# Altium schematic sheet 开关.SchDoc
size A2
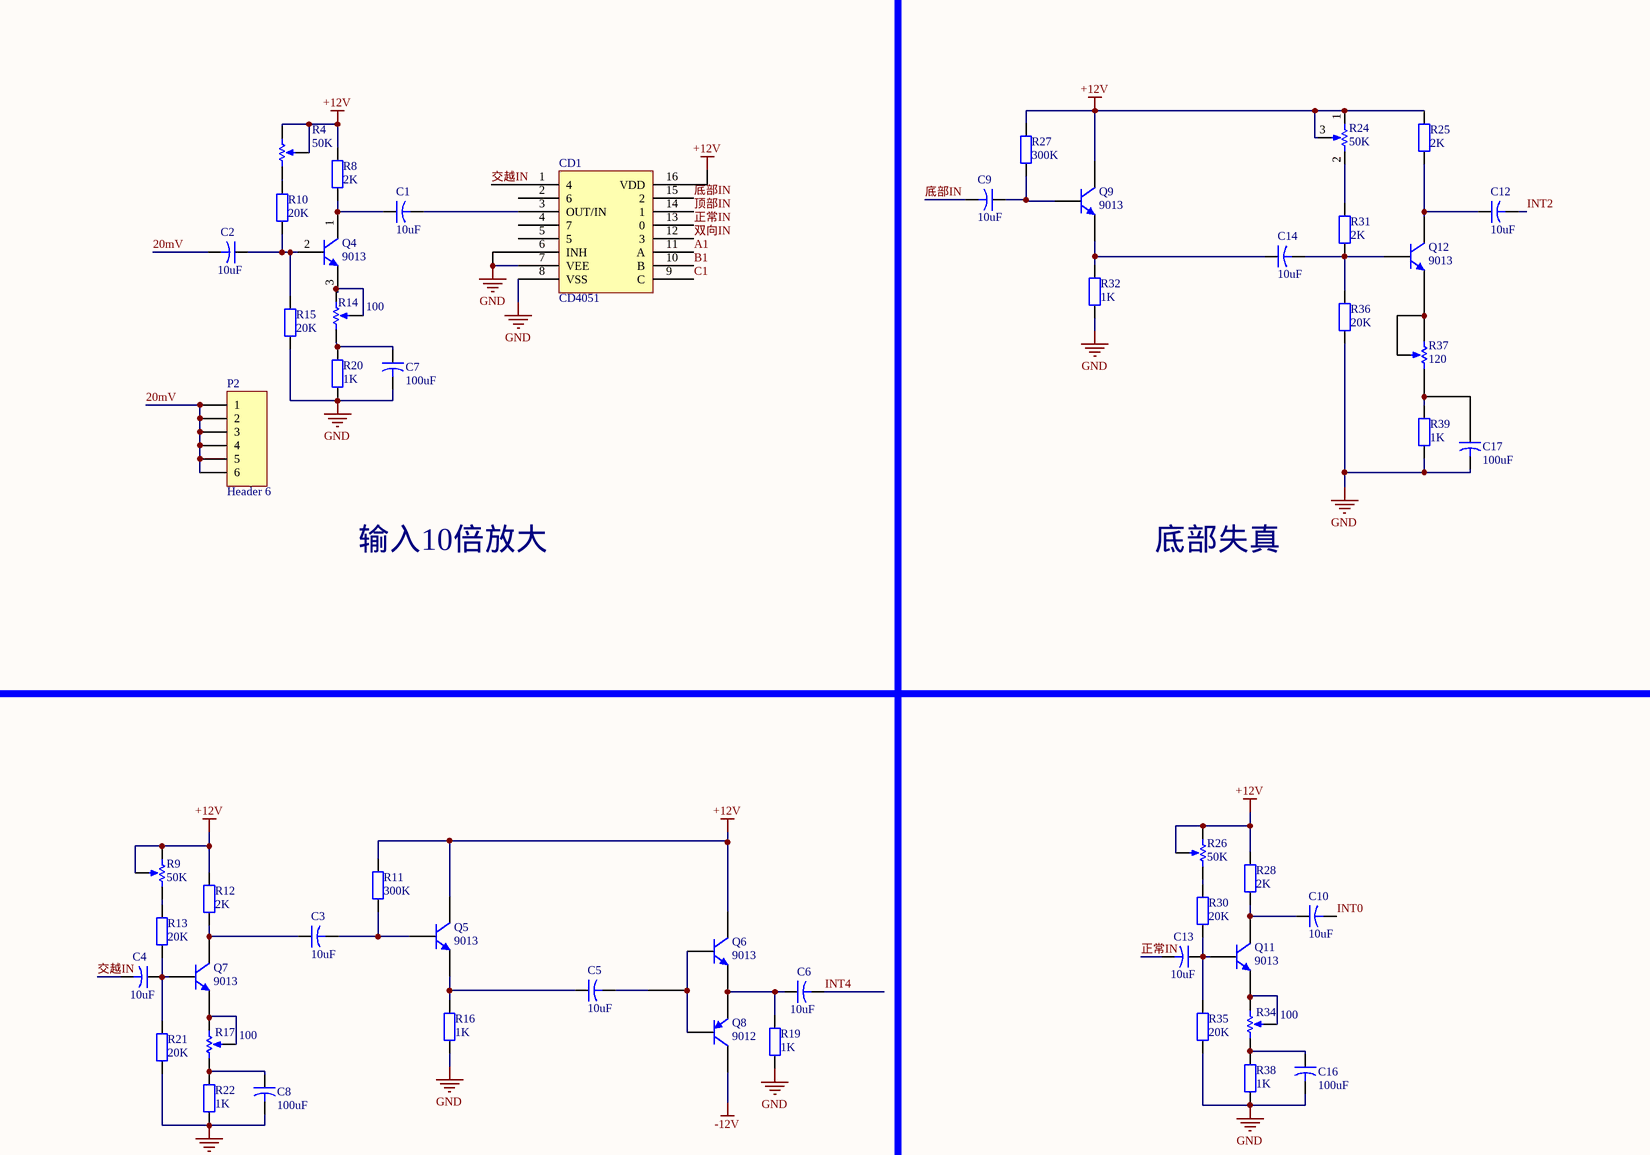
[diagram p0: 开关.SchDoc, top left]
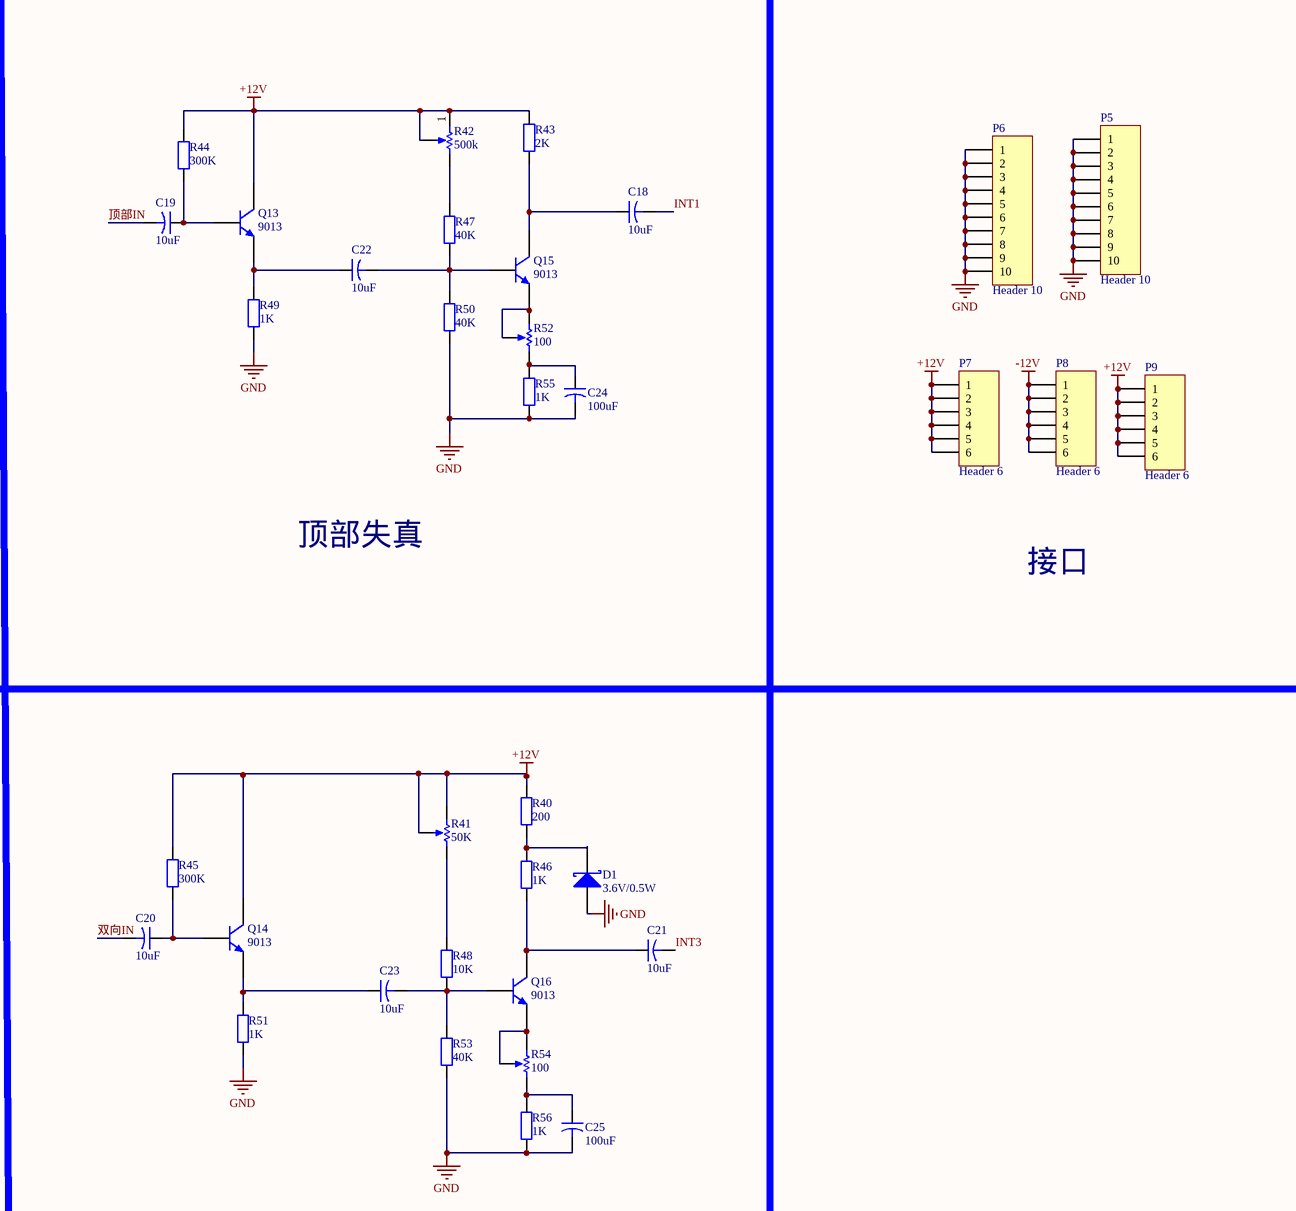
[diagram p1: 开关.SchDoc, top right]
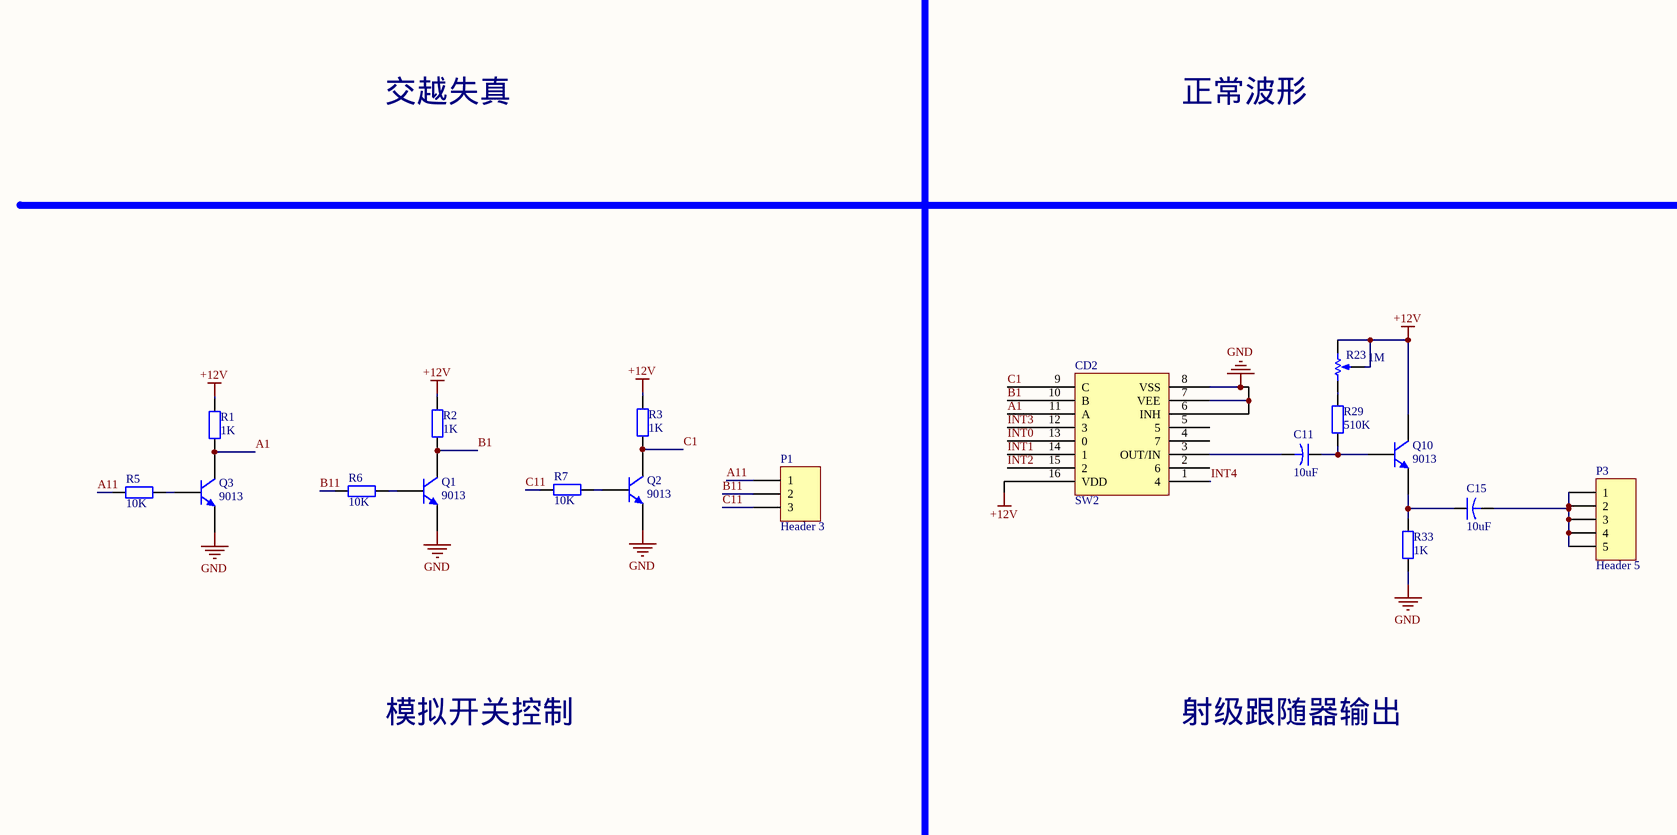
[diagram p2: 开关.SchDoc, bottom left]
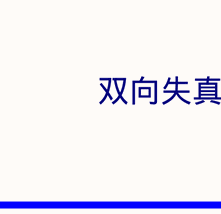
[diagram p3: 开关.SchDoc, bottom right]

## Parts
C1  10uF  [CAPR5-4X5]
C2  10uF  [CAPR5-4X5]
C3  10uF  [CAPR5-4X5]
C4  10uF  [CAPR5-4X5]
C5  10uF  [CAPR5-4X5]
C6  10uF  [CAPR5-4X5]
C7  100uF  [CAPR5-4X5]
C8  100uF  [CAPR5-4X5]
C9  10uF  [CAPR5-4X5]
C10  10uF  [CAPR5-4X5]
C11  10uF  [CAPR5-4X5]
C12  10uF  [CAPR5-4X5]
C13  10uF  [CAPR5-4X5]
C14  10uF  [CAPR5-4X5]
C15  10uF  [CAPR5-4X5]
C16  100uF  [CAPR5-4X5]
C17  100uF  [CAPR5-4X5]
C18  10uF  [CAPR5-4X5]
C19  10uF  [CAPR5-4X5]
C20  10uF  [CAPR5-4X5]
C21  10uF  [CAPR5-4X5]
C22  10uF  [CAPR5-4X5]
C23  10uF  [CAPR5-4X5]
C24  100uF  [CAPR5-4X5]
C25  100uF  [CAPR5-4X5]
CD1  CD4051  [DIP-16]
CD2  SW2  [DIP-16]
D1  3.6V/0.5W  [DO-41]
P1  Header 3  [HDR1X3]
P2  Header 6  [HDR1X6]
P3  Header 5  [HDR1X5]
P5  Header 10  [HDR1X10]
P6  Header 10  [HDR1X10]
P7  Header 6  [HDR1X6]
P8  Header 6  [HDR1X6]
P9  Header 6  [HDR1X6]
Q1  9013  [HDR1X3]
Q2  9013  [HDR1X3]
Q3  9013  [HDR1X3]
Q4  9013  [HDR1X3]
Q5  9013  [HDR1X3]
Q6  9013  [HDR1X3]
Q7  9013  [HDR1X3]
Q8  9012  [HDR1X3]
Q9  9013  [HDR1X3]
Q10  9013  [HDR1X3]
Q11  9013  [HDR1X3]
Q12  9013  [HDR1X3]
Q13  9013  [HDR1X3]
Q14  9013  [HDR1X3]
Q15  9013  [HDR1X3]
Q16  9013  [HDR1X3]
R1  1K  [AXIAL-0.4]
R2  1K  [AXIAL-0.4]
R3  1K  [AXIAL-0.4]
R4  50K  [VR5]
R5  10K  [AXIAL-0.4]
R6  10K  [AXIAL-0.4]
R7  10K  [AXIAL-0.4]
R8  2K  [AXIAL-0.4]
R9  50K  [VR5]
R10  20K  [AXIAL-0.4]
R11  300K  [AXIAL-0.4]
R12  2K  [AXIAL-0.4]
R13  20K  [AXIAL-0.4]
R14  100  [VR5]
R15  20K  [AXIAL-0.4]
R16  1K  [AXIAL-0.4]
R17  100  [VR5]
R19  1K  [AXIAL-0.4]
R20  1K  [AXIAL-0.4]
R21  20K  [AXIAL-0.4]
R22  1K  [AXIAL-0.4]
R23  1M  [VR5]
R24  50K  [VR5]
R25  2K  [AXIAL-0.4]
R26  50K  [VR5]
R27  300K  [AXIAL-0.4]
R28  2K  [AXIAL-0.4]
R29  510K  [AXIAL-0.4]
R30  20K  [AXIAL-0.4]
R31  2K  [AXIAL-0.4]
R32  1K  [AXIAL-0.4]
R33  1K  [AXIAL-0.4]
R34  100  [VR5]
R35  20K  [AXIAL-0.4]
R36  20K  [AXIAL-0.4]
R37  120  [VR5]
R38  1K  [AXIAL-0.4]
R39  1K  [AXIAL-0.4]
R40  200  [AXIAL-0.4]
R41  50K  [VR5]
R42  500k  [VR5]
R43  2K  [AXIAL-0.4]
R44  300K  [AXIAL-0.4]
R45  300K  [AXIAL-0.4]
R46  1K  [AXIAL-0.4]
R47  40K  [AXIAL-0.4]
R48  10K  [AXIAL-0.4]
R49  1K  [AXIAL-0.4]
R50  40K  [AXIAL-0.4]
R51  1K  [AXIAL-0.4]
R52  100  [VR5]
R53  40K  [AXIAL-0.4]
R54  100  [VR5]
R55  1K  [AXIAL-0.4]
R56  1K  [AXIAL-0.4]

## Nets
+12V: CD1.16(VDD) CD2.16(VDD) P7.1 P7.2 P7.3 P7.4 P7.5 P7.6 P9.1 P9.2 P9.3 P9.4 P9.5 P9.6 Q5.1(C) Q6.1(C) Q9.1(C) Q10.1(C) Q13.1(C) Q14.1(C) R1.2 R2.2 R3.2 R4.2(BOT) R4.3(TAP) R8.2 R9.1(TOP) R9.3(TAP) R11.2 R12.2 R23.2(BOT) R23.3(TAP) R24.1(TOP) R24.3(TAP) R25.2 R26.1(TOP) R26.3(TAP) R27.2 R28.2 R40.2 R41.1(TOP) R41.3(TAP) R42.1(TOP) R42.3(TAP) R43.2 R44.2 R45.2
-12V: P8.1 P8.2 P8.3 P8.4 P8.5 P8.6 Q8.1(C)
GND: C7.2 C8.2 C16.2 C17.2 C24.2 C25.2 CD1.6(INH) CD1.7(VEE) CD1.8(VSS) CD2.6(INH) CD2.7(VEE) CD2.8(VSS) D1.1(A) P5.1 P5.2 P5.3 P5.4 P5.5 P5.6 P5.7 P5.8 P5.9 P5.10 P6.1 P6.2 P6.3 P6.4 P6.5 P6.6 P6.7 P6.8 P6.9 P6.10 Q1.3(E) Q2.3(E) Q3.3(E) R15.1 R16.1 R19.1 R20.1 R21.1 R22.1 R32.1 R33.1 R35.1 R36.1 R38.1 R39.1 R49.1 R50.1 R51.1 R53.1 R55.1 R56.1
20mV: C2.2 P2.1 P2.2 P2.3 P2.4 P2.5 P2.6
A1: CD1.11(A) CD2.11(A) Q3.1(C) R1.1
A11: P1.1 R5.2
B1: CD1.10(B) CD2.10(B) Q1.1(C) R2.1
B11: P1.2 R6.2
C1: CD1.9(C) CD2.9(C) Q2.1(C) R3.1
C11: P1.3 R7.2
INT0: C10.2 CD2.13(0)
INT1: C18.2 CD2.14(1)
INT2: C12.2 CD2.15(2)
INT3: C21.2 CD2.12(3)
INT4: C6.2 CD2.1(4)
交越IN: C4.2 CD1.1(4)
双向IN: C20.2 CD1.12(3)
底部IN: C9.2 CD1.15(2)
正常IN: C13.2 CD1.13(0)
顶部IN: C19.2 CD1.14(1)
NetC1_1: C1.1 Q4.1(C) R8.1
NetC1_2: C1.2 CD1.3(OUT/IN)
NetC2_1: C2.1 Q4.2(B) R10.1 R15.2
NetC3_1: C3.1 Q7.1(C) R12.1
NetC3_2: C3.2 Q5.2(B) R11.1
NetC4_1: C4.1 Q7.2(B) R13.1 R21.2
NetC5_1: C5.1 Q5.3(E) R16.2
NetC5_2: C5.2 Q6.2(B) Q8.2(B)
NetC6_1: C6.1 Q6.3(E) Q8.3(E) R19.2
NetC7_1: C7.1 R14.1(TOP) R20.2
NetC8_1: C8.1 R17.1(TOP) R22.2
NetC9_1: C9.1 Q9.2(B) R27.1
NetC10_1: C10.1 Q11.1(C) R28.1
NetC11_1: C11.1 Q10.2(B) R29.1
NetC11_2: C11.2 CD2.3(OUT/IN)
NetC12_1: C12.1 Q12.1(C) R25.1
NetC13_1: C13.1 Q11.2(B) R30.1 R35.2
NetC14_1: C14.1 Q9.3(E) R32.2
NetC14_2: C14.2 Q12.2(B) R31.1 R36.2
NetC15_1: C15.1 Q10.3(E) R33.2
NetC15_2: C15.2 P3.1 P3.2 P3.3 P3.4 P3.5
NetC16_1: C16.1 R34.1(TOP) R38.2
NetC17_1: C17.1 R37.2(BOT) R39.2
NetC18_1: C18.1 Q15.1(C) R43.1
NetC19_1: C19.1 Q13.2(B) R44.1
NetC20_1: C20.1 Q14.2(B) R45.1
NetC21_1: C21.1 Q16.1(C) R46.1
NetC22_1: C22.1 Q13.3(E) R49.2
NetC22_2: C22.2 Q15.2(B) R47.1 R50.2
NetC23_1: C23.1 Q14.3(E) R51.2
NetC23_2: C23.2 Q16.2(B) R48.1 R53.2
NetC24_1: C24.1 R52.2(BOT) R55.2
NetC25_1: C25.1 R54.2(BOT) R56.2
NetD1_2: D1.2(K) R40.1 R46.2
NetQ1_2: Q1.2(B) R6.1
NetQ2_2: Q2.2(B) R7.1
NetQ3_2: Q3.2(B) R5.1
NetQ4_3: Q4.3(E) R14.2(BOT) R14.3(TAP)
NetQ7_3: Q7.3(E) R17.2(BOT) R17.3(TAP)
NetQ11_3: Q11.3(E) R34.2(BOT) R34.3(TAP)
NetQ12_3: Q12.3(E) R37.1(TOP) R37.3(TAP)
NetQ15_3: Q15.3(E) R52.1(TOP) R52.3(TAP)
NetQ16_3: Q16.3(E) R54.1(TOP) R54.3(TAP)
NetR4_1: R4.1(TOP) R10.2
NetR9_2: R9.2(BOT) R13.2
NetR23_1: R23.1(TOP) R29.2
NetR24_2: R24.2(BOT) R31.2
NetR26_2: R26.2(BOT) R30.2
NetR41_2: R41.2(BOT) R48.2
NetR42_2: R42.2(BOT) R47.2

Not connected (* = marked no-connect by the designer): CD1 2(6) 4(7) 5; CD2 2(6) 4(7) 5

## Notes on the sheet
- 输入10倍放大
- 底部失真
- 顶部失真
- 接口
- 交越失真
- 正常波形
- 双向失真
- 模拟开关控制
- 射级跟随器输出
- Title
- Size:
- Date:
- File:
- A2
- Number:
- Time:
- Revision:
- Sheet
- of

## Library data of the parts
C1-C25 = Cap2: Capacitor; Published: 23-Sep-2002; PackageReference: CAPR5-4X5; Publisher: Altium Limited; PackageDescription: Capacitor; 2 Leads
CD1 CD2 = SW?
D1 = D Schottky: Schottky Diode; Published: 8-Jun-2000; LatestRevisionDate: 17-Jul-2002; LatestRevisionNote: Re-released for DXP Platform.; PackageReference: SMB; Publisher: Altium Limited; PackageDescription: DO-214-AA/SMB; 2 C-Bend Leads; Body 5.3 x 3.6 mm, inc. leads (LxW); Code_JEDEC: DO-214-AA
P1 = Header 3: Header, 3-Pin; LatestRevisionDate: 17-Jul-2002; LatestRevisionNote: Re-released for DXP Platform.; Publisher: Altium Limited
P2 P7-P9 = Header 6: Header, 6-Pin; LatestRevisionDate: 17-Jul-2002; LatestRevisionNote: Re-released for DXP Platform.; Publisher: Altium Limited
P3 = Header 5: Header, 5-Pin; LatestRevisionDate: 17-Jul-2002; LatestRevisionNote: Re-released for DXP Platform.; Publisher: Altium Limited
P5 P6 = Header 10: Header, 10-Pin; LatestRevisionDate: 17-Jul-2002; LatestRevisionNote: Re-released for DXP Platform.; Publisher: Altium Limited
Q1-Q7 Q9-Q16 = NPN: NPN Bipolar Transistor; pin to pad: 1>3 3>1; Published: 8-Jun-2000; LatestRevisionDate: 17-Jul-2002; LatestRevisionNote: Re-released for DXP Platform.; PackageReference: TO-226-AA; Publisher: Altium Limited; PackageDescription: TO, Flat Index; 3 In-Line, Axial Leads; Body Dia. 4.8mm; Leads 0.55 x 0.51 mm (max); Code_JEDEC: TO-226-AA
Q8 = PNP: PNP Bipolar Transistor; Published: 8-Jun-2000; LatestRevisionDate: 29-May-2009; LatestRevisionNote: IPC-7351 Footprint Added.; PackageVersion: Aug-1999; PackageReference: SOT-23B; Publisher: Altium Limited; PackageDescription: 3-Pin SOT-23 Package 0.95 mm Pitch, 2.4 mm Lead Span
R1-R3 R5-R8 R10-R13 R15 R16 R19-R22 R25 R27-R33 R35 R36 R38-R40 R43-R51 R53 R55 R56 = Res2: Resistor; Published: 8-Jun-2000; LatestRevisionDate: 17-Jul-2002; LatestRevisionNote: Re-released for DXP Platform.; PackageReference: AXIAL-0.4; Publisher: Altium Limited; PackageDescription: Axial Device, Thru-Hole; 2 Leads; 0.4 in Pin Spacing
R4 R9 R14 R17 R23 R24 R26 R34 R37 R41 R42 R52 R54 = RPot: Potentiometer; pin to pad: 2>3 3>2; Sim Note: Enter the Resistance value and the set point into parameter fields.; Set Position: 0.5; Published: 8-Jun-2000; LatestRevisionDate: 17-Jul-2002; LatestRevisionNote: Re-released for DXP Platform.; PackageReference: VR5; Publisher: Altium Limited; PackageDescription: Variable Resistor, Thru-Hole; 3 Leads